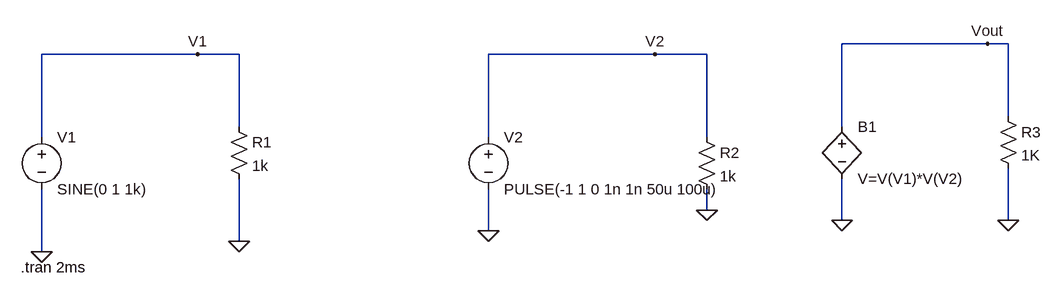
[diagram p0: schematic figure6.asc]
figure6.asc, the LTspice schematic file:
Version 4
SHEET 1 1000 680
WIRE 912 -16 688 -16
WIRE 944 -16 912 -16
WIRE -304 0 -544 0
WIRE -240 0 -304 0
WIRE 400 0 144 0
WIRE 480 0 400 0
WIRE 944 96 944 -16
WIRE -240 112 -240 0
WIRE 688 112 688 -16
WIRE -544 128 -544 0
WIRE 144 128 144 0
WIRE 480 128 480 0
WIRE 480 240 480 208
WIRE 688 256 688 192
WIRE 944 256 944 176
WIRE 144 272 144 208
WIRE -240 288 -240 192
WIRE -544 304 -544 208
FLAG 144 272 0
FLAG 480 240 0
FLAG -240 288 0
FLAG -544 304 0
FLAG -304 0 V1
FLAG 400 0 V2
FLAG 688 256 0
FLAG 944 256 0
FLAG 912 -16 Vout
SYMBOL voltage -544 112 R0
WINDOW 123 0 0 Left 0
WINDOW 39 0 0 Left 0
SYMATTR InstName V1
SYMATTR Value SINE(0 1 1k)
SYMBOL voltage 144 112 R0
WINDOW 123 0 0 Left 0
WINDOW 39 0 0 Left 0
SYMATTR InstName V2
SYMATTR Value PULSE(-1 1 0 1n 1n 50u 100u)
SYMBOL res -256 96 R0
SYMATTR InstName R1
SYMATTR Value 1k
SYMBOL res 464 112 R0
SYMATTR InstName R2
SYMATTR Value 1k
SYMBOL bv 688 96 R0
SYMATTR InstName B1
SYMATTR Value V=V(V1)*V(V2)
SYMBOL res 928 80 R0
SYMATTR InstName R3
SYMATTR Value 1K
TEXT -576 328 Left 2 !.tran 2ms

The netlist it stands for:
* figure6.asc
V1 V1 0 SINE(0 1 1k)
V2 V2 0 PULSE(-1 1 0 1n 1n 50u 100u)
R1 V1 0 1k
R2 V2 0 1k
B1 Vout 0 V=V(V1)*V(V2)
R3 Vout 0 1K
.tran 2ms
.backanno
.end